# Altium schematic sheet TheStaticTurtle_oshw-sdi3g-fiber__schematic_V4-Reclocked_OSHW_BiDi_SDI_Fiber_Converter_V4_Reclocker_2024-11-17__SDI.schdoc
size 698 x 245 mm
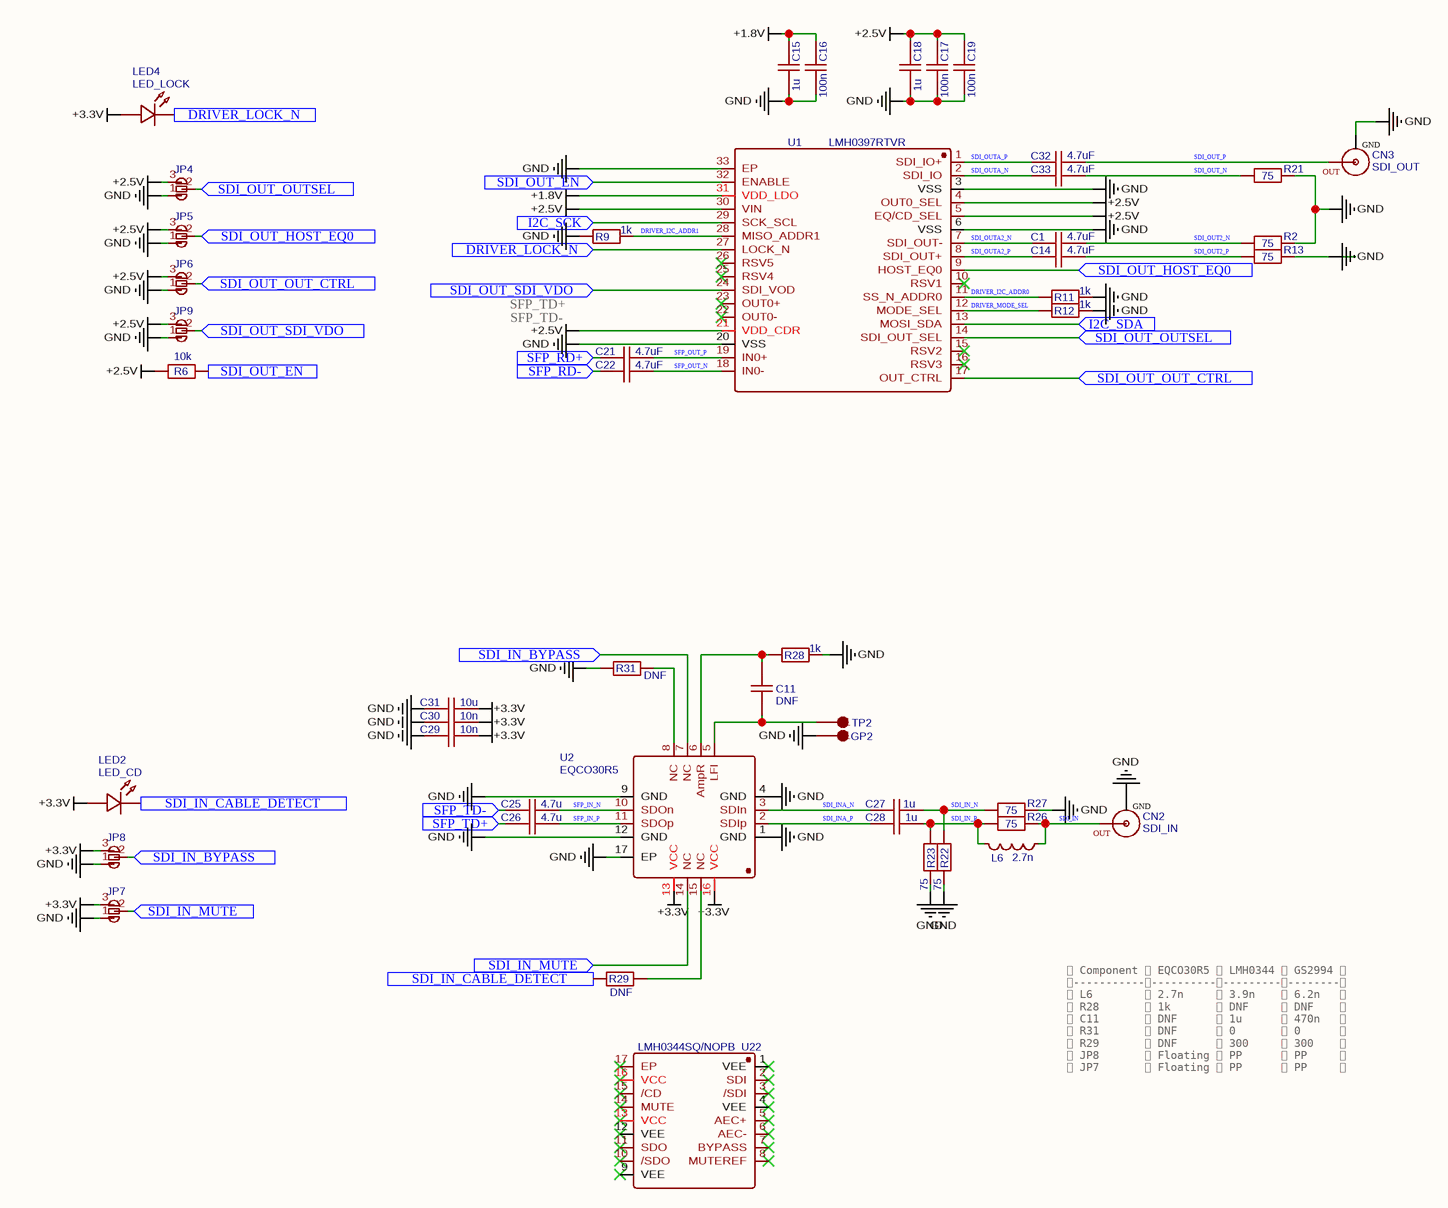
[diagram p0: TheStaticTurtle_oshw-sdi3g-fiber__schematic_V4-Reclocked_OSHW_BiDi_SDI_Fiber_Converter_V4_Reclocker_2024-11-17__SDI.schdoc]

## Parts
C1  4.7uF  [C0603]
C11  DNF  [C0603]
C14  4.7uF  [C0603]
C15  1u  [C0603]
C16  100n  [C0603]
C17  100n  [C0603]
C18  1u  [C0603]
C19  100n  [C0603]
C21  4.7uF  [C0603]
C22  4.7uF  [C0603]
C25  4.7u  [C0603]
C26  4.7u  [C0603]
C27  1u  [C0603]
C28  1u  [C0603]
C29  10n  [C0603]
C30  10n  [C0603]
C31  10u  [C0603]
C32  4.7uF  [C0603]
C33  4.7uF  [C0603]
CN2  SDI_IN  [AMPHENOLRF_034-1030-12G]
CN3  SDI_OUT  [AMPHENOLRF_034-1030-12G]
GP2  TEST-POINT-PTH-1X1  [TESTPOINT-SMD_L1.6-W0.8_RCU-0C]  (value not drawn)
JP4  SOLDER BRIDGE 3P  [SOLDER BRIDGE 3P]  (value not drawn)
JP5  SOLDER BRIDGE 3P  [SOLDER BRIDGE 3P]  (value not drawn)
JP6  SOLDER BRIDGE 3P  [SOLDER BRIDGE 3P]  (value not drawn)
JP7  SOLDER BRIDGE 3P  [SOLDER BRIDGE 3P]  (value not drawn)
JP8  SOLDER BRIDGE 3P  [SOLDER BRIDGE 3P]  (value not drawn)
JP9  SOLDER BRIDGE 3P  [SOLDER BRIDGE 3P]  (value not drawn)
L6  2.7n  [L0603]
LED2  LED_CD  [LED0805_GREEN]
LED4  LED_LOCK  [LED0805_GREEN]
R2  75  [R0603]
R6  10k  [R0603]
R9  1k  [R0603]
R11  1k  [R0603]
R12  1k  [R0603]
R13  75  [R0603]
R21  75  [R0603]
R22  75  [R0603]
R23  75  [R0603]
R26  75  [R0603]
R27  75  [R0603]
R28  1k  [R0603]
R29  DNF  [R0603]
R31  DNF  [R0603]
TP2  TEST-POINT-PTH-1X1  [TESTPOINT-SMD_L1.6-W0.8_RCU-0C]  (value not drawn)
U1  LMH0397RTVR  [QFN-32_L5.0-W5.0-P0.50-TL-EP3.5-1]
U2  EQCO30R5  [QFN16G-0.65-4X4MM]
U22  LMH0344SQ/NOPB  [QFN-16_L4.0-W4.0-P0.65-BL-EP2.6]

## Ports
DRIVER_LOCK_N (in), I2C_SCK (in), I2C_SDA (in), SDI_IN_BYPASS (in), SDI_IN_CABLE_DETECT (in), SDI_IN_MUTE (in), SDI_OUT_EN (in), SDI_OUT_HOST_EQ0 (in), SDI_OUT_OUT_CTRL (in), SDI_OUT_OUTSEL (in), SDI_OUT_SDI_VDO (in), SFP_RD+ (in), SFP_RD- (in), SFP_TD+ (in), SFP_TD- (in)

## Nets
+1.8V: C15.2 C16.2 U1.31(VDD_LDO)
+2.5V: C17.2 C18.2 C19.2 JP4.3(B) JP5.3(B) JP6.3(B) JP9.3(B) R6.1 U1.4(OUT0_SEL) U1.5(EQ/CD_SEL) U1.21(VDD_CDR) U1.30(VIN)
+3.3V: C29.2 C30.2 C31.2 JP7.3(B) JP8.3(B) LED2.1 LED4.1 U2.13(VCC) U2.16(VCC)
GND: C15.1 C16.1 C17.1 C18.1 C19.1 C29.1 C30.1 C31.1 CN2.GND CN3.GND GP2.1 JP4.1(A) JP5.1(A) JP6.1(A) JP7.1(A) JP8.1(A) JP9.1(A) R2.2 R9.2 R11.1 R12.1 R13.2 R21.2 R22.1 R23.1 R27.2 R28.1 R31.2 U1.3(VSS) U1.6(VSS) U1.20(VSS) U1.33(EP) U2.1(GND) U2.4(GND) U2.9(GND) U2.12(GND) U2.17(EP)
DRIVER_I2C_ADDR0: R11.2 U1.11(SS_N_ADDR0)
DRIVER_I2C_ADDR1: R9.1 U1.28(MISO_ADDR1)
DRIVER_LOCK_N: LED4.2 U1.27(LOCK_N) ; port DRIVER_LOCK_N
DRIVER_MODE_SEL: R12.2 U1.12(MODE_SEL)
I2C_SCK: U1.29(SCK_SCL) ; port I2C_SCK
I2C_SDA: U1.13(MOSI_SDA) ; port I2C_SDA
SDI_IN: CN2.1(OUT) L6.1 R26.2
SDI_IN_BYPASS: JP8.2(B) U2.7(NC) ; port SDI_IN_BYPASS
SDI_IN_CABLE_DETECT: LED2.2 R29.2 ; port SDI_IN_CABLE_DETECT
SDI_IN_MUTE: JP7.2(B) U2.14(NC) ; port SDI_IN_MUTE
SDI_IN_N: C27.2 R22.2 R27.1
SDI_IN_P: C28.2 L6.2 R23.2 R26.1
SDI_INA_N: C27.1 U2.3(SDIn)
SDI_INA_P: C28.1 U2.2(SDIp)
SDI_OUT2_N: C1.2 R2.1
SDI_OUT2_P: C14.2 R13.1
SDI_OUT_EN: R6.2 U1.32(ENABLE) ; port SDI_OUT_EN
SDI_OUT_HOST_EQ0: JP5.2(B) U1.9(HOST_EQ0) ; port SDI_OUT_HOST_EQ0
SDI_OUT_N: C33.2 R21.1
SDI_OUT_OUT_CTRL: JP6.2(B) U1.17(OUT_CTRL) ; port SDI_OUT_OUT_CTRL
SDI_OUT_OUTSEL: JP4.2(B) U1.14(SDI_OUT_SEL) ; port SDI_OUT_OUTSEL
SDI_OUT_P: C32.2 CN3.1(OUT)
SDI_OUT_SDI_VDO: JP9.2(B) U1.24(SDI_VOD) ; port SDI_OUT_SDI_VDO
SDI_OUTA2_N: C1.1 U1.7(SDI_OUT-)
SDI_OUTA2_P: C14.1 U1.8(SDI_OUT+)
SDI_OUTA_N: C33.1 U1.2(SDI_IO)
SDI_OUTA_P: C32.1 U1.1(SDI_IO+)
SFP_IN_N: C25.2 U2.10(SDOn)
SFP_IN_P: C26.2 U2.11(SDOp)
SFP_OUT_N: C22.2 U1.18(IN0-)
SFP_OUT_P: C21.2 U1.19(IN0+)
SFP_RD+: C21.1 ; port SFP_RD+
SFP_RD-: C22.1 ; port SFP_RD-
SFP_TD+: C26.1 ; port SFP_TD+
SFP_TD-: C25.1 ; port SFP_TD-
NetC11_1: C11.1 TP2.1 U2.5(LFI)
NetC11_2: C11.2 R28.2 U2.6(AmpR)
NetR29_1: R29.1 U2.15(NC)
NetR31_1: R31.1 U2.8(NC)

Not connected (* = marked no-connect by the designer): U1 10(RSV1)* 15(RSV2)* 16(RSV3)* 22(OUT0-)* 23(OUT0+)* 25(RSV4)* 26(RSV5)*; U22 1(VEE)* 2(SDI)* 3(/SDI)* 4(VEE)* 5(AEC+)* 6(AEC-)* 7(BYPASS)* 8(MUTEREF)* 9(VEE)* 10(/SDO)* 11(SDO)* 12(VEE)* 13(VCC)* 14(MUTE)* 15(/CD)* 16(VCC)* 17(EP)*

## Notes on the sheet
- SFP_TD+
- SFP_TD-
-  Component  EQCO30R5  LMH0344  GS2994 
  --------------------------------------
   L6         2.7n      3.9n     6.2n   
   R28        1k        DNF      DNF    
   C11        DNF       1u       470n   
   R31        DNF       0        0      
   R29        DNF       300      300    
   JP8        Floating  PP       PP     
   JP7        Floating  PP       PP     

## Library data of the parts
C1 C14 C21 C22 C32 C33 = 4.7uF: nameAlias: Value(F); Contributor: LCEDA_Lib; spicePre: C; spiceSymbolName: C_0603_US
C11 = DNF: nameAlias: Value(F); Contributor: LCEDA_Lib; spicePre: C; spiceSymbolName: C_0603_US
C15 C18 C27 C28 = 1u: nameAlias: Value(F); Contributor: LCEDA_Lib; spicePre: C; spiceSymbolName: C_0603_US
C16 C17 C19 = 100n: nameAlias: Value(F); Contributor: LCEDA_Lib; spicePre: C; spiceSymbolName: C_0603_US
C25 C26 = 4.7u: nameAlias: Value(F); Contributor: LCEDA_Lib; spicePre: C; spiceSymbolName: C_0603_US
C29 C30 = 10n: nameAlias: Value(F); Contributor: LCEDA_Lib; spicePre: C; spiceSymbolName: C_0603_US
C31 = 10u: nameAlias: Value(F); Contributor: LCEDA_Lib; spicePre: C; spiceSymbolName: C_0603_US
JP4-JP9 = SOLDER BRIDGE 3P: Contributor: TheStaticTurtle; spicePre: U; spiceSymbolName: SOLDER BRIDGE 3P
L6 = 2.7n: nameAlias: Value(H); Contributor: LCEDA_Lib; spicePre: L; spiceSymbolName: L0603_US
LED2 = LED_CD: Manufacturer: 国星光电; Manufacturer Part: NCD0805G1; Contributor: LCEDA_Lib; Supplier Part: C84260; spicePre: L; spiceSymbolName: LED-0805_G
LED4 = LED_LOCK: Manufacturer: 国星光电; Manufacturer Part: NCD0805G1; Contributor: LCEDA_Lib; Supplier Part: C84260; spicePre: L; spiceSymbolName: LED-0805_G
R2 R13 R21-R23 R26 R27 = 75: nameAlias: Value(Ω); Contributor: LCEDA_Lib; spicePre: R; spiceSymbolName: R_0603_EU
R6 = 10k: nameAlias: Value(Ω); Contributor: LCEDA_Lib; spicePre: R; spiceSymbolName: R_0603_EU
R9 R11 R12 R28 = 1k: nameAlias: Value(Ω); Contributor: LCEDA_Lib; spicePre: R; spiceSymbolName: R_0603_EU
R29 R31 = DNF: nameAlias: Value(Ω); Contributor: LCEDA_Lib; spicePre: R; spiceSymbolName: R_0603_EU
U1 = LMH0397RTVR: Manufacturer: TI(德州仪器); Contributor: LCSC; Supplier: LCSC; Supplier Part: C2652750; Manufacturer Part: LMH0397RTVR; JLCPCB Part Class: Extended Part; spicePre: U; spiceSymbolName: LMH0397RTVR
U2 = EQCO30R5: Manufacturer: Microchip; Contributor: turtleforgaming; Manufacturer Part: EQCO30R5; link: https://www.microchip.com/en-us/product/eqco30r5; spicePre: U; spiceSymbolName: EQCO30R5
U22 = LMH0344SQ/NOPB: Manufacturer: TI(德州仪器); Contributor: LCSC; Supplier: LCSC; Supplier Part: C191792; Manufacturer Part: LMH0344SQ/NOPB; JLCPCB Part Class: Extended Part; spicePre: U; spiceSymbolName: LMH0344SQ/NOPB
CN2 = SDI_IN: Supplier Part: 523-34-1030-12G; Supplier: Mouser; spicePre: C; spiceSymbolName: AMPHENOL RF - 034-1030-12G MINI BNC
CN3 = SDI_OUT: Supplier Part: 523-34-1030-12G; Supplier: Mouser; spicePre: C; spiceSymbolName: AMPHENOL RF - 034-1030-12G MINI BNC
GP2 TP2 = TEST-POINT-PTH-1X1: spicePre: T; spiceSymbolName: TEST-POINT-PTH-1X1